# EasyEDA schematic SCH_ipm_igbt_module_2025-05-30.json

## Sheets
1 Sheet_1: TITLE: Sheet_1; REV: 1.0; Date: 2023-06-06; Sheet: 1/1; Drawn By: Mohamed Lamane; Company: USMS
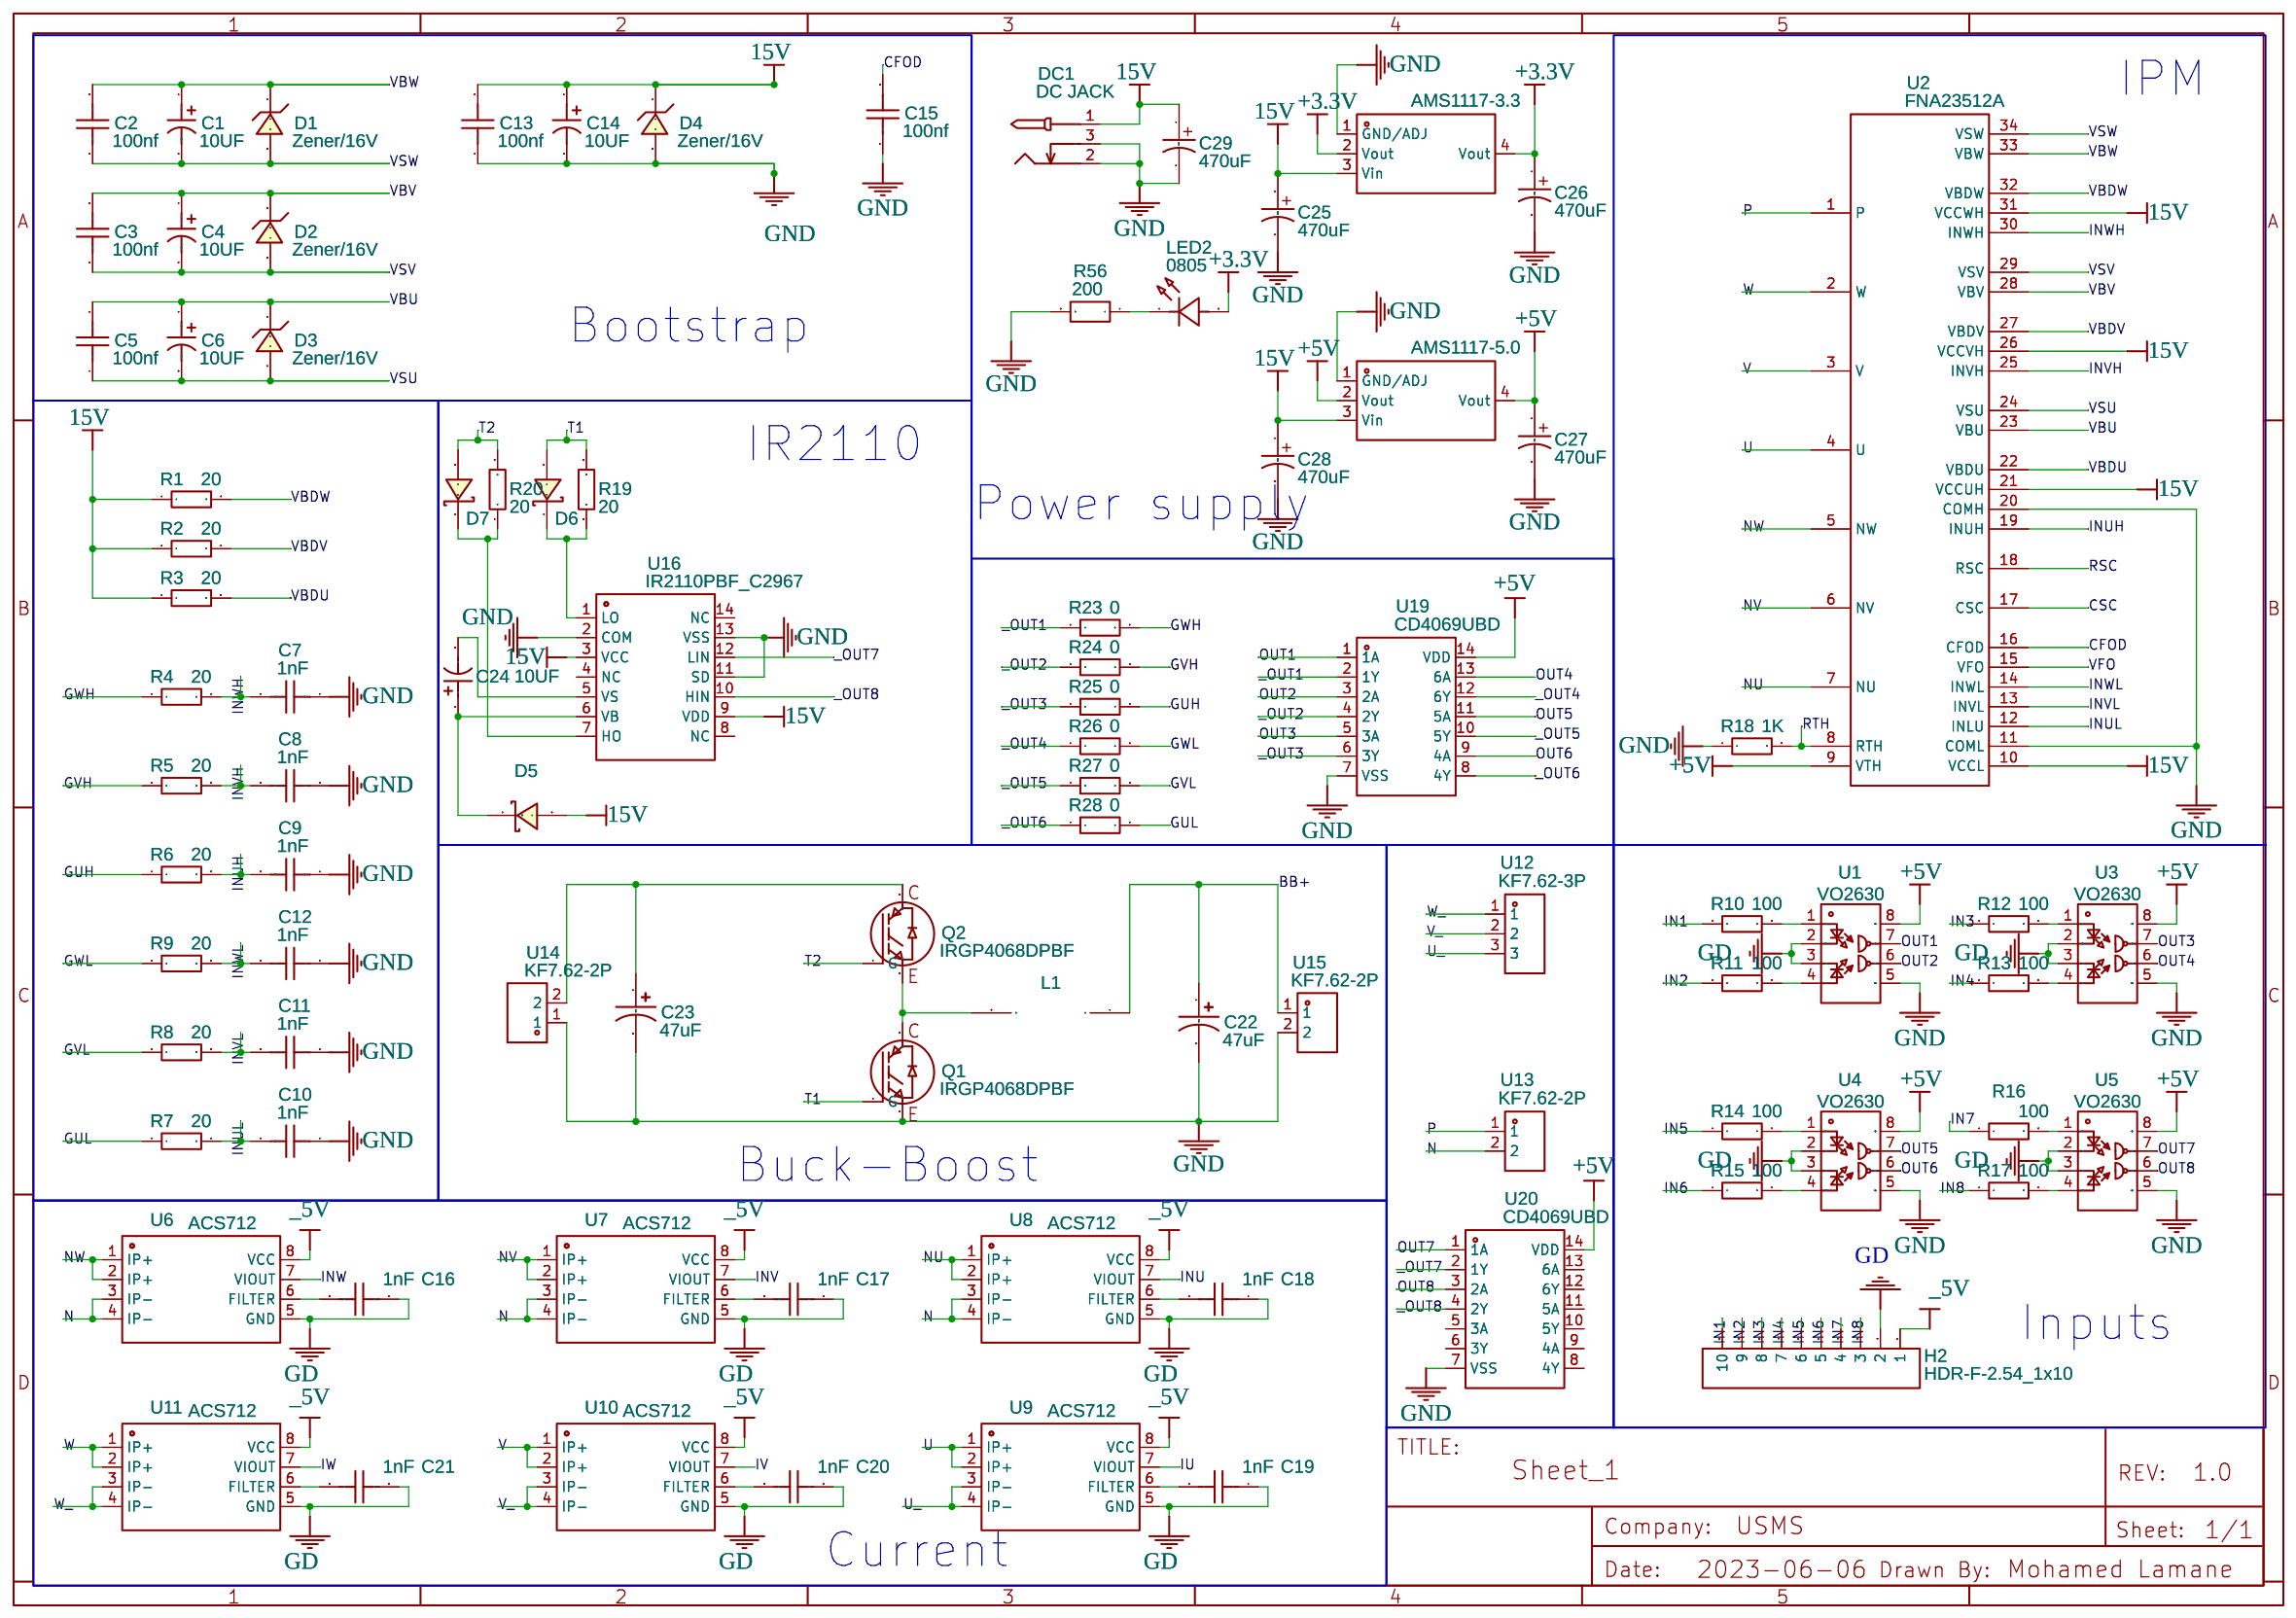
[diagram p0: Sheet_1]
2 Sheet_2: TITLE: Sheet_2; Date: 2023-06-07; Drawn By: com.lamane; Company: Your Company
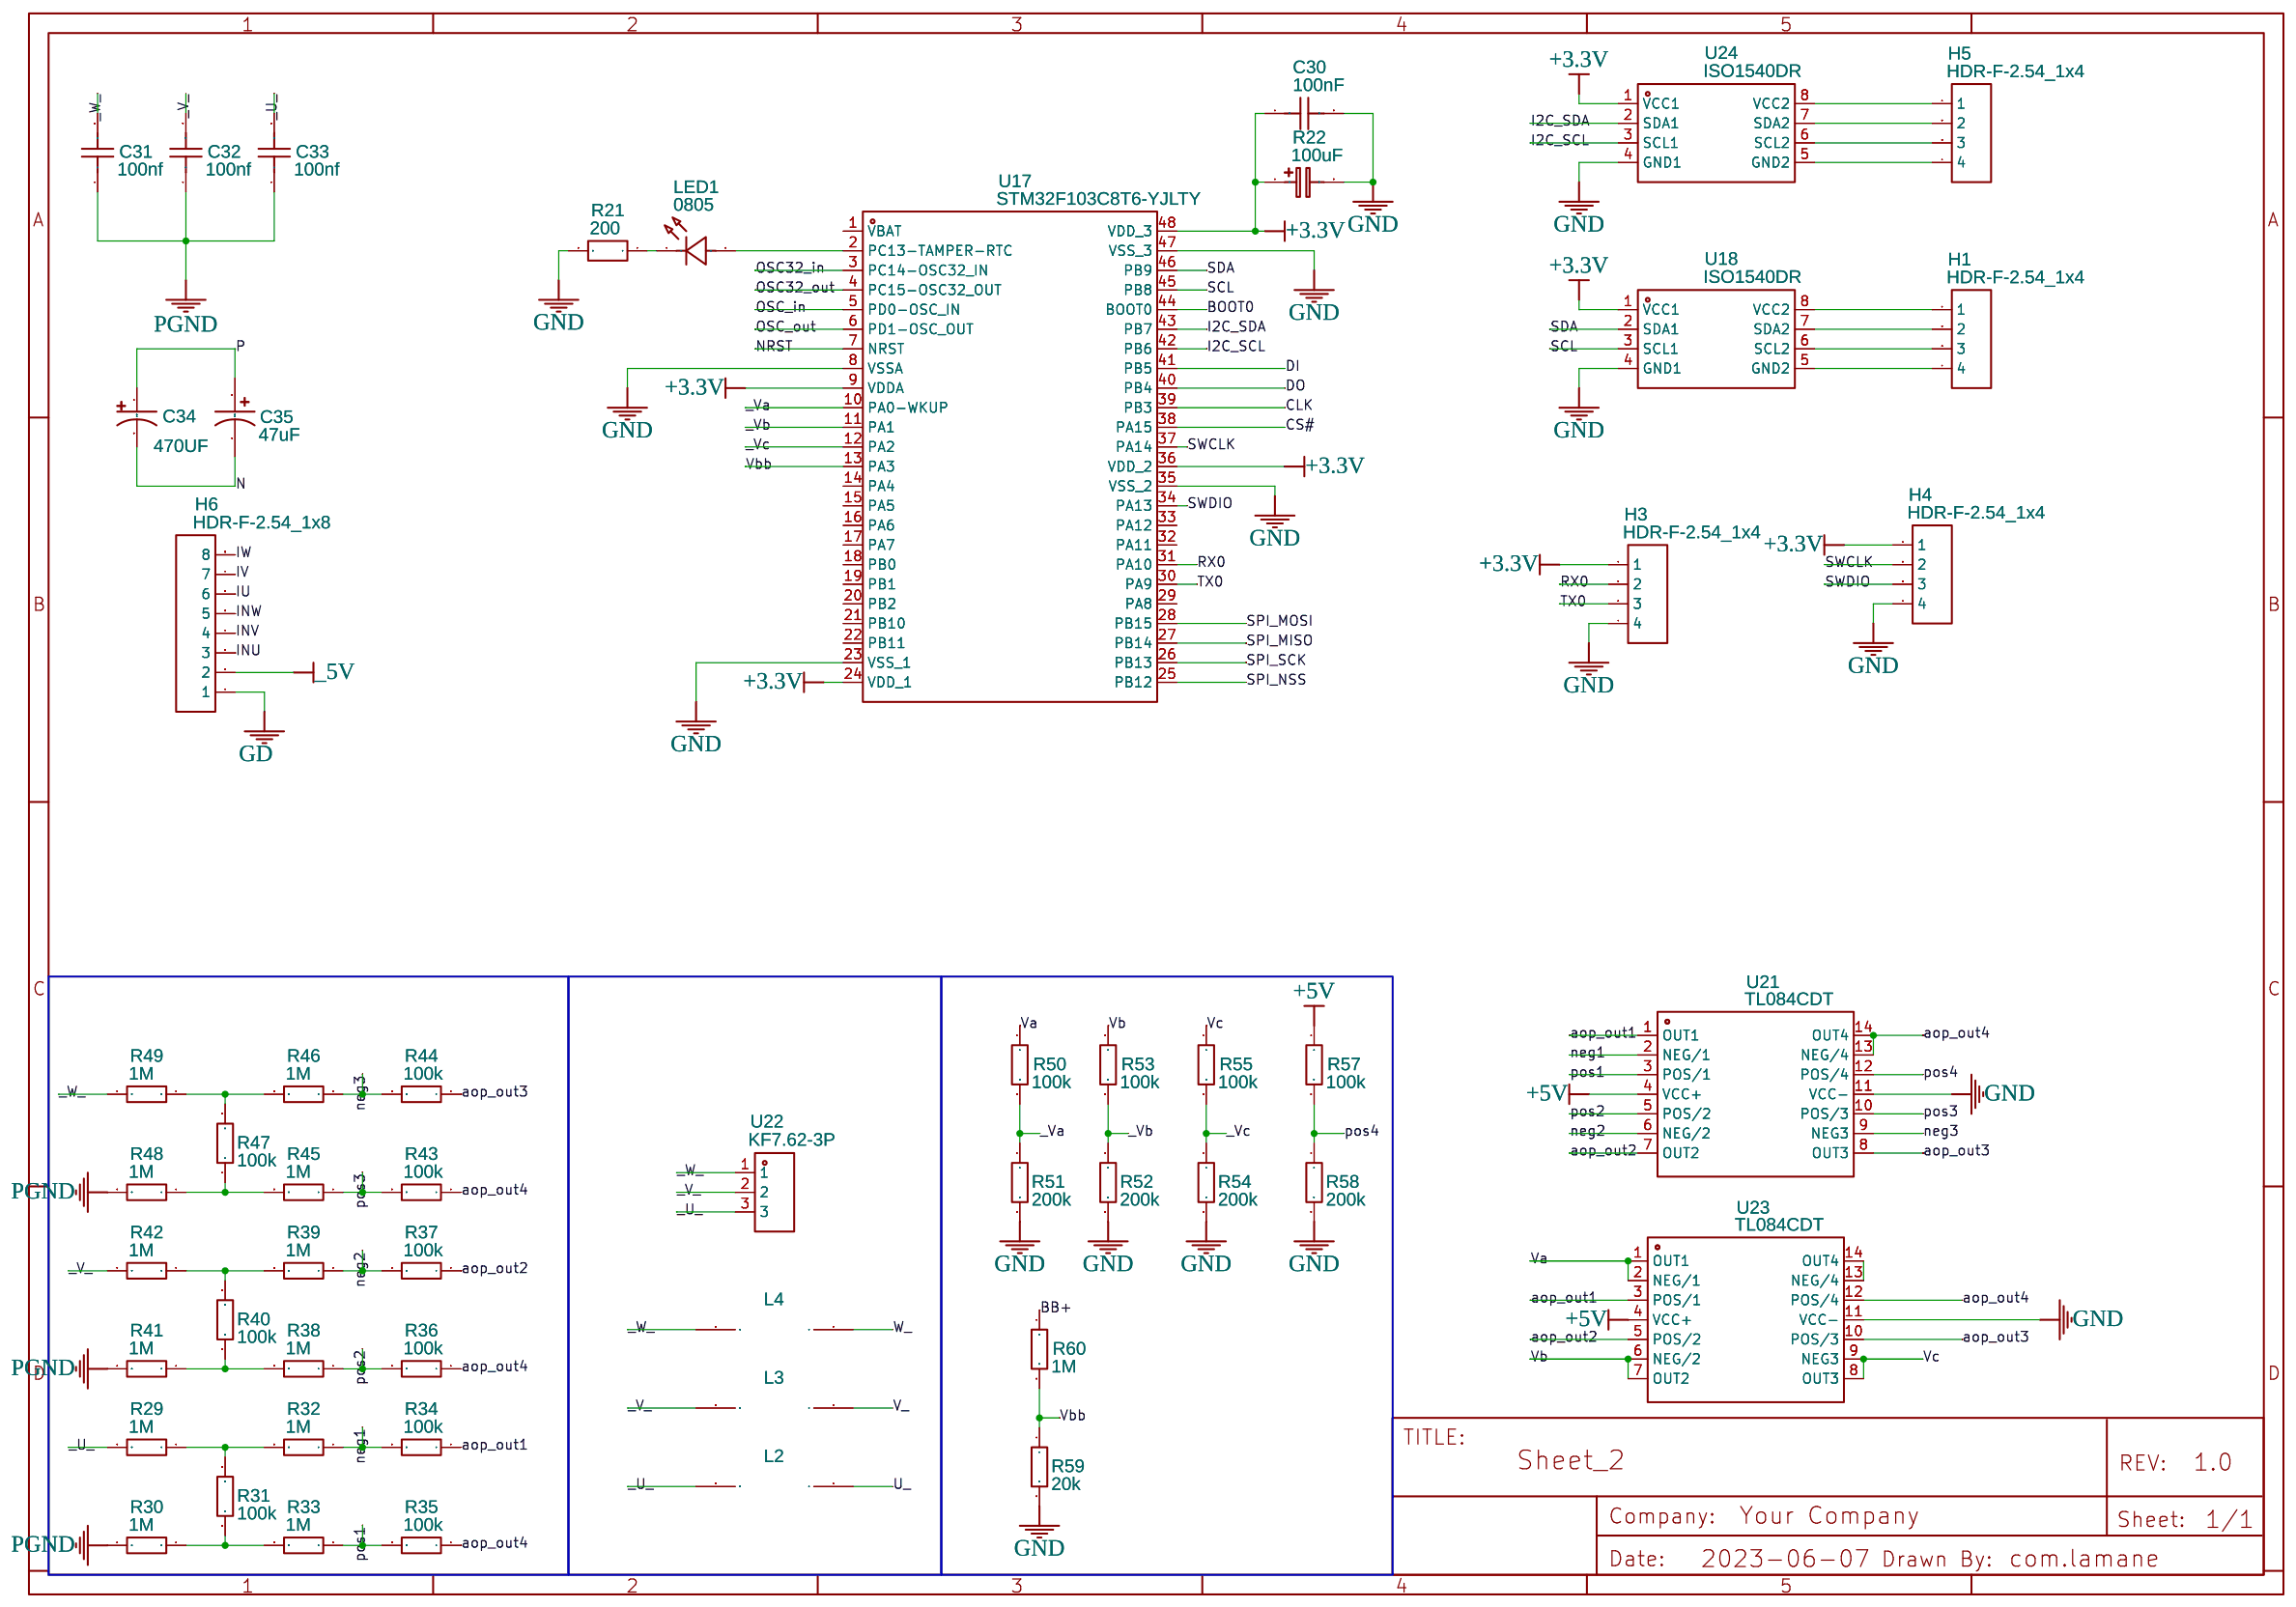
[diagram p1: Sheet_2]

## Parts
sheet Sheet_1
C1  10UF  [CAP-TH_BD5.0-P2.00-D0.6-FD]
C2  100nf  [C0805]
C3  100nf  [C0805]
C4  10UF  [CAP-TH_BD5.0-P2.00-D0.6-FD]
C5  100nf  [C0805]
C6  10UF  [CAP-TH_BD5.0-P2.00-D0.6-FD]
C7  1nF  [C0805]
C8  1nF  [C0805]
C9  1nF  [C0805]
C10  1nF  [C0805]
C11  1nF  [C0805]
C12  1nF  [C0805]
C13  100nf  [C0805]
C14  10UF  [CAP-TH_BD5.0-P2.00-D0.6-FD]
C15  100nf  [C0805]
C16  1nF  [C0805]
C17  1nF  [C0805]
C18  1nF  [C0805]
C19  1nF  [C0805]
C20  1nF  [C0805]
C21  1nF  [C0805]
C22  47uF  [CAP-TH_BD16.0-P7.50-D1.2-FD]
C23  47uF  [CAP-TH_BD16.0-P7.50-D1.2-FD]
C24  10UF  [CAP-TH_BD5.0-P2.00-D0.6-FD]
C25  470uF  [SMD, 8X10.2MM]
C26  470uF  [SMD, 8X10.2MM]
C27  470uF  [SMD, 8X10.2MM]
C28  470uF  [SMD, 8X10.2MM]
C29  470uF  [SMD, 8X10.2MM]
D1  Zener/16V  [SOD-323_L1.8-W1.3-LS2.5-RD]
D2  Zener/16V  [SOD-323_L1.8-W1.3-LS2.5-RD]
D3  Zener/16V  [SOD-323_L1.8-W1.3-LS2.5-RD]
D4  Zener/16V  [SOD-323_L1.8-W1.3-LS2.5-RD]
D5  SODFL250X10-2N  [SOD-323_L1.7-W1.3-LS2.5-RD]
D6  SODFL250X10-2N  [SOD-323_L1.7-W1.3-LS2.5-RD]
D7  SODFL250X10-2N  [SOD-323_L1.7-W1.3-LS2.5-RD]
DC1  DC JACK  [DC JACK]
H2  HDR-F-2.54_1x10  [HDR-F-2.54_1X10]
L1  indu  [INDF]
LED2  0805  [LED0805-RD]
NO1  AMS1117-3.3  [SOT-223-3_L6.5-W3.4-P2.30-LS7.0-BR]
NO2  AMS1117-5.0  [SOT-223-3_L6.5-W3.4-P2.30-LS7.0-BR]
Q1  IRGP4068DPBF  [TO-247-3_L15.9-W5.1-P5.44-L]
Q2  IRGP4068DPBF  [TO-247-3_L15.9-W5.1-P5.44-L]
R1  20  [R0603]
R2  20  [R0603]
R3  20  [R0603]
R4  20  [R0603]
R5  20  [R0603]
R6  20  [R0603]
R7  20  [R0603]
R8  20  [R0603]
R9  20  [R0603]
R10  100  [R0603]
R11  100  [R0603]
R12  100  [R0603]
R13  100  [R0603]
R14  100  [R0603]
R15  100  [R0603]
R16  100  [R0603]
R17  100  [R0603]
R18  1K  [R0603]
R19  20  [R0603]
R20  20  [R0603]
R23  0  [R0603]
R24  0  [R0603]
R25  0  [R0603]
R26  0  [R0603]
R27  0  [R0603]
R28  0  [R0603]
R56  200  [R0805]
U1  VO2630  [SMD-8_L9.8-W6.5-P2.54-LS10.0-BL]
U2  FNA23512A  [COMM-TH_SPMCA-A34]
U3  VO2630  [SMD-8_L9.8-W6.5-P2.54-LS10.0-BL]
U4  VO2630  [SMD-8_L9.8-W6.5-P2.54-LS10.0-BL]
U5  VO2630  [SMD-8_L9.8-W6.5-P2.54-LS10.0-BL]
U6  ACS712  [SOIC-8_L5.0-W4.0-P1.27-LS6.0-BL]
U7  ACS712  [SOIC-8_L5.0-W4.0-P1.27-LS6.0-BL]
U8  ACS712  [SOIC-8_L5.0-W4.0-P1.27-LS6.0-BL]
U9  ACS712  [SOIC-8_L5.0-W4.0-P1.27-LS6.0-BL]
U10  ACS712  [SOIC-8_L5.0-W4.0-P1.27-LS6.0-BL]
U11  ACS712  [SOIC-8_L5.0-W4.0-P1.27-LS6.0-BL]
U12  KF7.62-3P  [CONN-TH_KF7.62-3P]
U13  KF7.62-2P  [CONN-TH_KF7.62-2P]
U14  KF7.62-2P  [CONN-TH_KF7.62-2P]
U15  KF7.62-2P  [CONN-TH_KF7.62-2P]
U16  IR2110PBF_C2967  [DIP-14_L20.0-W7.6-P2.54-LS7.6-BL]
U19  CD4069UBD  [SOP-14_L8.6-W3.9-P1.27-LS6.0-BL]
U20  CD4069UBD  [SOP-14_L8.6-W3.9-P1.27-LS6.0-BL]
sheet Sheet_2
C30  100nF  [C0805]
C31  100nf  [CAP-TH_L17.0-W8.5-P15.00-D1.2-FD]
C32  100nf  [CAP-TH_L17.0-W8.5-P15.00-D1.2-FD]
C33  100nf  [CAP-TH_L17.0-W8.5-P15.00-D1.2-FD]
C34  470UF  [470UF/400V]
C35  47uF  [CAP-TH_BD16.0-P7.50-D1.2-FD]
H1  HDR-F-2.54_1x4  [HDR-F-2.54_1X4]
H3  HDR-F-2.54_1x4  [HDR-F-2.54_1X4]
H4  HDR-F-2.54_1x4  [HDR-F-2.54_1X4]
H5  HDR-F-2.54_1x4  [HDR-F-2.54_1X4]
H6  HDR-F-2.54_1x8  [HDR-F-2.54_1X8]
L2  indu  [INDF]
L3  indu  [INDF]
L4  indu  [INDF]
LED1  0805  [LED0805-RD]
R21  200  [R0805]
R22  100uF  [CASE-A_3216]
R29  1M  [R0603]
R30  1M  [R0603]
R31  100k  [R0603]
R32  1M  [R0603]
R33  1M  [R0603]
R34  100k  [R0603]
R35  100k  [R0603]
R36  100k  [R0603]
R37  100k  [R0603]
R38  1M  [R0603]
R39  1M  [R0603]
R40  100k  [R0603]
R41  1M  [R0603]
R42  1M  [R0603]
R43  100k  [R0603]
R44  100k  [R0603]
R45  1M  [R0603]
R46  1M  [R0603]
R47  100k  [R0603]
R48  1M  [R0603]
R49  1M  [R0603]
R50  100k  [R0603]
R51  200k  [R0603]
R52  200k  [R0603]
R53  100k  [R0603]
R54  200k  [R0603]
R55  100k  [R0603]
R57  100k  [R0603]
R58  200k  [R0603]
R59  20k  [R0603]
R60  1M  [R0603]
U17  STM32F103C8T6-YJLTY  [QFP-48_L7.0-W7.0-P0.50-LS9.0-BL]
U18  ISO1540DR  [SOIC-8_L4.9-W3.9-P1.27-LS6.0-BL]
U21  TL084CDT  [SOIC-14_L8.7-W3.9-P1.27-LS6.0-BL]
U22  KF7.62-3P  [CONN-TH_KF7.62-3P]
U23  TL084CDT  [SOIC-14_L8.7-W3.9-P1.27-LS6.0-BL]
U24  ISO1540DR  [SOIC-8_L4.9-W3.9-P1.27-LS6.0-BL]

## Library data of the parts
C1 C4 C6 C14 C24 = 10UF/25V-C5X11DIP: Supplier: LCSC; Supplier Part: C9900003841; Manufacturer Part: 10uF/25V-C5X11DIP; JLCPCB Part Class: Extended Part; Contributor: LCSC
C2 C3 C5 C7-C13 C15-C21 = AC0805KKX7R9BB474: Supplier: LCSC; Supplier Part: C726586; Manufacturer: null; JLCPCB Part Class: Extended Part; Contributor: LCSC; Capacitance: 470nF
C22 C23 C35 = ECG2GM470L26OTBO: Supplier: LCSC; Supplier Part: C711610; Manufacturer: Yunxing; Contributor: LCSC
C25-C29 = EEEFK1A471GP: Supplier: LCSC; Manufacturer: PANASONIC; Supplier Part: C401652; Contributor: paulb
D1-D4 = MM3Z10VST1G: Supplier: LCSC; Supplier Part: C235983; Manufacturer: onsemi(安森美); Contributor: LCSC; JLCPCB Part Class: Extended Part
D5-D7 = SODFL250X10-2N: Supplier: LCSC; Supplier Part: C9900003953; Manufacturer: null; JLCPCB Part Class: Extended Part; link: https://cn.bing.com/search?q=datasheet%3A+%20SODFL250X10-2N; Contributor: LCSC
DC1 = DC JACK: Supplier: LCSC; Manufacturer: SOFNG; Manufacturer Part: DC005-2.0MM; Supplier Part: C111567
H2 = HDR-F-2.54_1x10: Supplier Part: C35445; Supplier: LCSC; Contributor: LCEDA_Lib
L1-L4 = indu: Contributor: com.lamane
LED1 LED2 = D21121000251-LED0805_R: Supplier: LCSC; Supplier Part: C9900004154; Manufacturer: null; Contributor: LCSC; JLCPCB Part Class: Extended Part
NO1 NO2 = AMS1117-3.3-YJLTY: Supplier: LCSC; Supplier Part: C9900003397; JLCPCB Part Class: Extended Part; Contributor: LCSC; Manufacturer: null
Q1 Q2 = IRGP4068DPBF: Supplier: LCSC; Manufacturer: IR; image: //image.lceda.cn/szlcsc/C10878.jpg; Supplier Part: C10878
R1-R20 R23-R55 R57-R60 = 8K1%-R0603: Supplier: LCSC; Supplier Part: C9900012436; Manufacturer: null; JLCPCB Part Class: Extended Part; Contributor: LCSC
R21 R56 = PTFR0805B9K10P9: Supplier: LCSC; Supplier Part: C2849395; Manufacturer: RESI(开步睿思）; Contributor: LCSC; JLCPCB Part Class: Extended Part
U1 U3-U5 = VO2630-X007T: Supplier: LCSC; Supplier Part: C5334386; Manufacturer: VISHAY(威世); link: https://atta.szlcsc.com/upload/public/pdf/source/20221230/1F3B673851FE5DAE4A3AD91D07465CEA.pdf; Contributor: lcsc
U2 = FNA23512A: Supplier: LCSC; Supplier Part: C906576; Manufacturer: ON(安森美); Contributor: LCSC; JLCPCB Part Class: Extended Part
U6-U11 = ACS712ELCTR-30A-T: Supplier: LCSC; Manufacturer: ALLEGRO(美国埃戈罗); Supplier Part: C9932; JLCPCB Part Class: Extended Part
U12 U22 = KF7.62-3P: Supplier: LCSC; Supplier Part: C707825; Manufacturer: KEFA(科发); Contributor: LCSC; JLCPCB Part Class: Extended Part
U13-U15 = KF7.62-2P: Supplier: LCSC; Supplier Part: C707824; Manufacturer: KEFA(科发); Contributor: LCSC; JLCPCB Part Class: Extended Part
U16 = IR2110PBF_C2967: Supplier: LCSC; Manufacturer: Infineon(英飞凌); Manufacturer Part: IR2110PBF; Supplier Part: C2967; JLCPCB Part Class: Extended Part
U19 U20 = CD4069UBD: Supplier: LCSC; Supplier Part: C510569; Manufacturer: HTC; Contributor: LCSC; JLCPCB Part Class: Extended Part
C30 = GRM216R71H103KA01D: Supplier: LCSC; Manufacturer: MuRata; Supplier Part: C77065
C31-C33 = 1uf/250V/CBBCapacitor: Supplier Part: C29321; Supplier: LCSC; Manufacturer: ReliaPro
C34 = 407UF/400V: Contributor: dr.alex
H1 H3-H5 = HDR-F-2.54_1x4: Supplier Part: C225501; Supplier: LCSC; Contributor: LCEDA_Lib
H6 = HDR-F-2.54_1x8: Supplier Part: C225505; Supplier: LCSC; Contributor: LCEDA_Lib
R22 = T520A107M006ATE045: Supplier: LCSC; Supplier Part: C212680; Manufacturer: KEMET(基美); JLCPCB Part Class: Extended Part; Contributor: LCSC
U17 = STM32F103C8T6-YJLTY: Supplier: LCSC; Supplier Part: C2911485; Manufacturer: null; JLCPCB Part Class: Extended Part; Contributor: LCSC
U18 U24 = ISO1540DR: Supplier: LCSC; Manufacturer: TI(德州仪器); Contributor: LCSC; Supplier Part: C179739; JLCPCB Part Class: Extended Part
U21 U23 = TL084CDT: Supplier: LCSC; Manufacturer: ST(意法半导体); Supplier Part: C11130; JLCPCB Part Class: Extended Part

## Nets
15V: C13.2 C14.1 C25.1 C28.1 C29.1 D4.1(K) D5.2(A) DC1.1 NO1.3(Vin) NO2.3(Vin) R1.1 R2.1 R3.1 U2.10(VCCL) U2.21(VCCUH) U2.26(VCCVH) U2.31(VCCWH) U16.3(VCC) U16.9(VDD)
+3.3V: C26.1 C30.1 H3.1 H4.1 LED2.2(A) NO1.2(Vout) NO1.4(Vout) R22.1 U17.9(VDDA) U17.24(VDD_1) U17.36(VDD_2) U17.48(VDD_3) U18.1(VCC1) U24.1(VCC1)
+5V: C27.1 NO2.2(Vout) NO2.4(Vout) R57.1 U1.8(VCC) U2.9(VTH) U3.8(VCC) U4.8(VCC) U5.8(VCC) U19.14(VDD) U20.14(VDD) U21.4(VCC+) U23.4(VCC+)
GND: C7.1 C8.1 C9.1 C10.1 C11.1 C12.1 C13.1 C14.2 C15.1 C22.2 C23.2 C25.2 C26.2 C27.2 C28.2 C29.2 C30.2 D4.2(A) DC1.2 DC1.3 H3.4 H4.4 NO1.1(GND/ADJ) NO2.1(GND/ADJ) Q1.3(E) R18.1 R21.2 R22.2 R51.2 R52.2 R54.2 R56.2 R58.2 R59.2 U1.5(GND) U2.11(COML) U2.20(COMH) U3.5(GND) U4.5(GND) U5.5(GND) U14.1 U15.2 U16.2(COM) U16.11(SD) U16.13(VSS) U17.8(VSSA) U17.23(VSS_1) U17.35(VSS_2) U17.47(VSS_3) U18.4(GND1) U19.7(VSS) U20.7(VSS) U21.11(VCC-) U23.11(VCC-) U24.4(GND1)
PGND: C31.1 C32.1 C33.1 R30.2 R41.2 R48.2
_5V: H2.1 H6.2 U6.8(VCC) U7.8(VCC) U8.8(VCC) U9.8(VCC) U10.8(VCC) U11.8(VCC)
_OUT1: R23.1 U19.2(1Y)
_OUT2: R24.1 U19.4(2Y)
_OUT3: R25.1 U19.6(3Y)
_OUT4: R26.1 U19.12(6Y)
_OUT5: R27.1 U19.10(5Y)
_OUT6: R28.1 U19.8(4Y)
_OUT7: U16.12(LIN) U20.2(1Y)
_OUT8: U16.10(HIN) U20.4(2Y)
_U_: C33.2 L2.2 R29.2 U22.3
_V_: C32.2 L3.2 R42.2 U22.2
_Va: R50.2 R51.1 U17.10(PA0-WKUP)
_Vb: R52.1 R53.2 U17.11(PA1)
_Vc: R54.1 R55.2 U17.12(PA2)
_W_: C31.2 L4.2 R49.2 U22.1
aop_out1: R34.1 U21.1(OUT1) U23.3(POS/1)
aop_out2: R37.1 U21.7(OUT2) U23.5(POS/2)
aop_out3: R44.1 U21.8(OUT3) U23.10(POS/3)
aop_out4: R35.1 R36.1 R43.1 U21.13(NEG/4) U21.14(OUT4) U23.12(POS/4)
BB+: C22.1 L1.1 R60.1 U15.1
BOOT0: U17.44(BOOT0)
CFOD: C15.2 U2.16(CFOD)
CLK: U17.39(PB3)
CS#: U17.38(PA15)
CSC: U2.17(CSC)
DI: U17.41(PB5)
DO: U17.40(PB4)
GD: C16.1 C17.1 C18.1 C19.1 C20.1 C21.1 H2.2 H6.1 U1.2(C1) U1.3(C2) U3.2(C1) U3.3(C2) U4.2(C1) U4.3(C2) U5.2(C1) U5.3(C2) U6.5(GND) U7.5(GND) U8.5(GND) U9.5(GND) U10.5(GND) U11.5(GND)
GUH: R6.1 R25.2
GUL: R7.1 R28.2
GVH: R5.1 R24.2
GVL: R8.1 R27.2
GWH: R4.1 R23.2
GWL: R9.1 R26.2
I2C_SCL: U17.42(PB6) U24.3(SCL1)
I2C_SDA: U17.43(PB7) U24.2(SDA1)
IN1: H2.10 R10.1
IN2: H2.9 R11.1
IN3: H2.8 R12.1
IN4: H2.7 R13.1
IN5: H2.6 R14.1
IN6: H2.5 R15.1
IN7: H2.4 R16.1
IN8: H2.3 R17.1
INU: H6.3 U8.7(VIOUT)
INUH: C9.2 R6.2 U2.19(INUH)
INUL: C10.2 R7.2 U2.12(INLU)
INV: H6.4 U7.7(VIOUT)
INVH: C8.2 R5.2 U2.25(INVH)
INVL: C11.2 R8.2 U2.13(INVL)
INW: H6.5 U6.7(VIOUT)
INWH: C7.2 R4.2 U2.30(INWH)
INWL: C12.2 R9.2 U2.14(INWL)
IU: H6.6 U9.7(VIOUT)
IV: H6.7 U10.7(VIOUT)
IW: H6.8 U11.7(VIOUT)
N: C34.2 C35.2 U6.3(IP-) U6.4(IP-) U7.3(IP-) U7.4(IP-) U8.3(IP-) U8.4(IP-) U13.2
neg1: R32.1 R34.2 U21.2(NEG/1)
neg2: R37.2 R39.1 U21.6(NEG/2)
neg3: R44.2 R46.1 U21.9(NEG3)
NRST: U17.7(NRST)
NU: U2.7(NU) U8.1(IP+) U8.2(IP+)
NV: U2.6(NV) U7.1(IP+) U7.2(IP+)
NW: U2.5(NW) U6.1(IP+) U6.2(IP+)
OSC32_in: U17.3(PC14-OSC32_IN)
OSC32_out: U17.4(PC15-OSC32_OUT)
OSC_in: U17.5(PD0-OSC_IN)
OSC_out: U17.6(PD1-OSC_OUT)
OUT1: U1.7(VO1) U19.1(1A)
OUT2: U1.6(VO2) U19.3(2A)
OUT3: U3.7(VO1) U19.5(3A)
OUT4: U3.6(VO2) U19.13(6A)
OUT5: U4.7(VO1) U19.11(5A)
OUT6: U4.6(VO2) U19.9(4A)
OUT7: U5.7(VO1) U20.1(1A)
OUT8: U5.6(VO2) U20.3(2A)
P: C34.1 C35.1 U2.1(P) U13.1
pos1: R33.1 R35.2 U21.3(POS/1)
pos2: R36.2 R38.1 U21.5(POS/2)
pos3: R43.2 R45.1 U21.10(POS/3)
pos4: R57.2 R58.1 U21.12(POS/4)
RSC: U2.18(RSC)
RTH: R18.2 U2.8(RTH)
RX0: H3.2 U17.31(PA10)
SCL: U17.45(PB8) U18.3(SCL1)
SDA: U17.46(PB9) U18.2(SDA1)
SPI_MISO: U17.27(PB14)
SPI_MOSI: U17.28(PB15)
SPI_NSS: U17.25(PB12)
SPI_SCK: U17.26(PB13)
SWCLK: H4.2 U17.37(PA14)
SWDIO: H4.3 U17.34(PA13)
T1: D6.2(A) Q1.1(G) R19.2
T2: D7.2(A) Q2.1(G) R20.2
TX0: H3.3 U17.30(PA9)
U: U2.4(U) U9.1(IP+) U9.2(IP+)
U_: L2.1 U9.3(IP-) U9.4(IP-) U12.3
V: U2.3(V) U10.1(IP+) U10.2(IP+)
V_: L3.1 U10.3(IP-) U10.4(IP-) U12.2
Va: R50.1 U23.1(OUT1) U23.2(NEG/1)
Vb: R53.1 U23.6(NEG/2) U23.7(OUT2)
Vbb: R59.1 R60.2 U17.13(PA3)
VBDU: R3.2 U2.22(VBDU)
VBDV: R2.2 U2.27(VBDV)
VBDW: R1.2 U2.32(VBDW)
VBU: C5.2 C6.1 D3.1(K) U2.23(VBU)
VBV: C3.2 C4.1 D2.1(K) U2.28(VBV)
VBW: C1.1 C2.2 D1.1(K) U2.33(VBW)
Vc: R55.1 U23.8(OUT3) U23.9(NEG3)
VFO: U2.15(VFO)
VSU: C5.1 C6.2 D3.2(A) U2.24(VSU)
VSV: C3.1 C4.2 D2.2(A) U2.29(VSV)
VSW: C1.2 C2.1 D1.2(A) U2.34(VSW)
W: U2.2(W) U11.1(IP+) U11.2(IP+)
W_: L4.1 U11.3(IP-) U11.4(IP-) U12.1
Net-(C16-2): C16.2 U6.6(FILTER)
Net-(C17-2): C17.2 U7.6(FILTER)
Net-(C18-2): C18.2 U8.6(FILTER)
Net-(C19-2): C19.2 U9.6(FILTER)
Net-(C20-2): C20.2 U10.6(FILTER)
Net-(C21-2): C21.2 U11.6(FILTER)
Net-(C23-1): C23.1 Q2.2(C) U14.2
Net-(C24-1): C24.1 D5.1(C) U16.6(VB)
Net-(C24-2): C24.2 U16.5(VS)
Net-(D6-1): D6.1(C) R19.1 U16.1(LO)
Net-(D7-1): D7.1(C) R20.1 U16.7(HO)
Net-(H1-1): H1.1 U18.8(VCC2)
Net-(H1-2): H1.2 U18.7(SDA2)
Net-(H1-3): H1.3 U18.6(SCL2)
Net-(H1-4): H1.4 U18.5(GND2)
Net-(H5-1): H5.1 U24.8(VCC2)
Net-(H5-2): H5.2 U24.7(SDA2)
Net-(H5-3): H5.3 U24.6(SCL2)
Net-(H5-4): H5.4 U24.5(GND2)
Net-(L1-2): L1.2 Q1.2(C) Q2.3(E)
Net-(LED1-1): LED1.1(K) R21.1
Net-(LED1-2): LED1.2(A) U17.2(PC13-TAMPER-RTC)
Net-(LED2-1): LED2.1(K) R56.1
Net-(R10-2): R10.2 U1.1(A1)
Net-(R11-2): R11.2 U1.4(A2)
Net-(R12-2): R12.2 U3.1(A1)
Net-(R13-2): R13.2 U3.4(A2)
Net-(R14-2): R14.2 U4.1(A1)
Net-(R15-2): R15.2 U4.4(A2)
Net-(R16-2): R16.2 U5.1(A1)
Net-(R17-2): R17.2 U5.4(A2)
Net-(R29-1): R29.1 R31.2 R32.2
Net-(R30-1): R30.1 R31.1 R33.2
Net-(R38-2): R38.2 R40.1 R41.1
Net-(R39-2): R39.2 R40.2 R42.1
Net-(R45-2): R45.2 R47.1 R48.1
Net-(R46-2): R46.2 R47.2 R49.1
Net-(U23-13): U23.13(NEG/4) U23.14(OUT4)

Not connected (* = marked no-connect by the designer): U16 4(NC) 8(NC) 14(NC); U17 1(VBAT) 14(PA4) 15(PA5) 16(PA6) 17(PA7) 18(PB0) 19(PB1) 20(PB2) 21(PB10) 22(PB11) 29(PA8) 32(PA11) 33(PA12); U20 5(3A) 6(3Y) 8(4Y) 9(4A) 10(5Y) 11(5A) 12(6Y) 13(6A)

## Notes on the sheets
sheet 1
- IPM
- Bootstrap
- IR2110
- Power supply
- Buck-Boost
- Inputs
- Current
